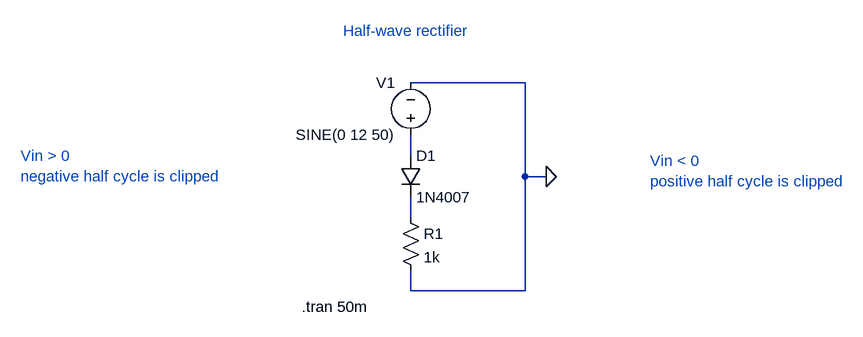
[diagram p0: schematic Half wave rectifier.asc]
Half wave rectifier.asc, the LTspice schematic file:
Version 4.1
SHEET 1 880 680
WIRE 304 32 128 32
WIRE 128 144 128 112
WIRE 304 176 304 32
WIRE 336 176 304 176
WIRE 128 240 128 208
WIRE 128 352 128 320
WIRE 304 352 304 176
WIRE 304 352 128 352
FLAG 336 176 0
SYMBOL voltage 128 128 R180
WINDOW 0 24 96 Left 2
WINDOW 3 24 16 Left 2
WINDOW 123 0 0 Left 0
WINDOW 39 0 0 Left 0
SYMATTR InstName V1
SYMATTR Value SINE(0 12 50)
SYMBOL diode 112 144 R0
SYMATTR InstName D1
SYMATTR Value 1N4007
SYMBOL res 112 224 R0
SYMATTR InstName R1
SYMATTR Value 1k
TEXT -40 376 Left 2 !.tran 50m
TEXT 24 -48 Left 2 ;Half-wave rectifier
TEXT -472 144 Left 2 ;Vin > 0\nnegative half cycle is clipped
TEXT 496 152 Left 2 ;Vin < 0\npositive half cycle is clipped

The netlist it stands for:
* Half wave rectifier.asc
V1 N001 0 SINE(0 12 50)
D1 N001 N002 1N4007
R1 N002 0 1k
.model D D
.lib standard.dio
.tran 50m
* Half-wave rectifier
* Vin > 0
* negative half cycle is clipped
* Vin < 0
* positive half cycle is clipped
.backanno
.end